# Altium schematic sheet 04_7SEG.SchDoc
size A4
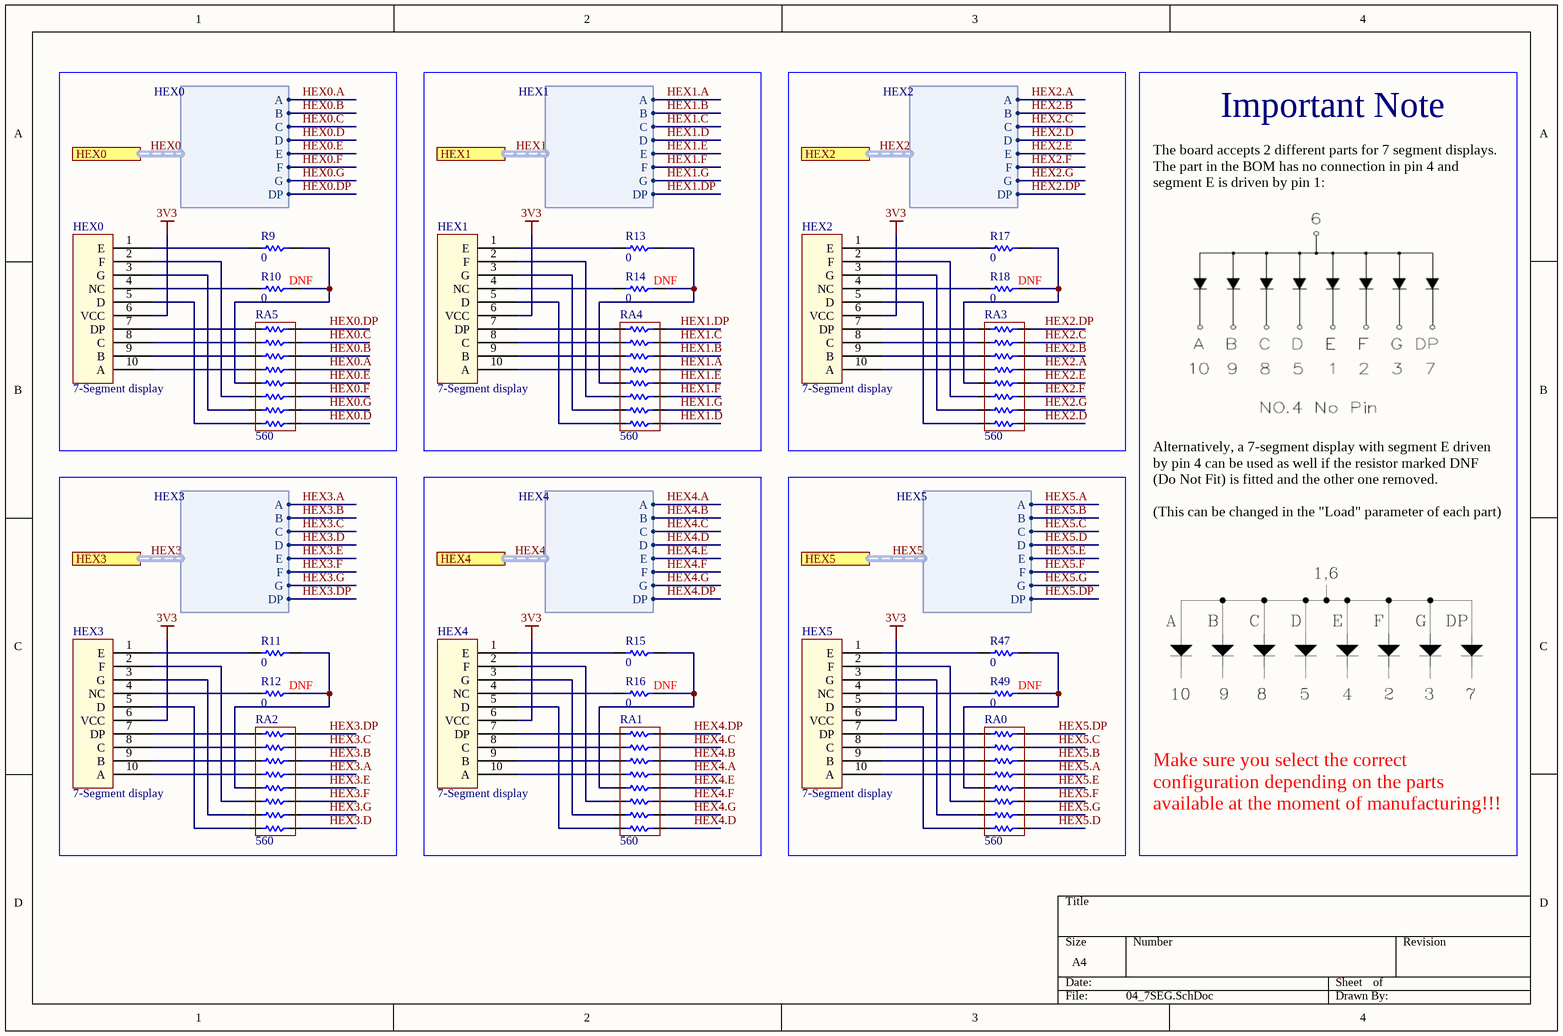
[diagram p0: 04_7SEG.SchDoc]

## Parts
HEX0  7-Segment display  [Seven_Seg_INND-TS40]
HEX1  7-Segment display  [Seven_Seg_INND-TS40]
HEX2  7-Segment display  [Seven_Seg_INND-TS40]
HEX3  7-Segment display  [Seven_Seg_INND-TS40]
HEX4  7-Segment display  [Seven_Seg_INND-TS40]
HEX5  7-Segment display  [Seven_Seg_INND-TS40]
R9  0  [RES0402R]
R10  Load: DNF  [RES0402R]  (hidden comment: 0)
R11  0  [RES0402R]
R12  Load: DNF  [RES0402R]  (hidden comment: 0)
R13  0  [RES0402R]
R14  Load: DNF  [RES0402R]  (hidden comment: 0)
R15  0  [RES0402R]
R16  Load: DNF  [RES0402R]  (hidden comment: 0)
R17  0  [RES0402R]
R18  Load: DNF  [RES0402R]  (hidden comment: 0)
R47  0  [RES0402R]
R49  Load: DNF  [RES0402R]  (hidden comment: 0)
RA0  value 560  [EXB-2HV]  (hidden comment: Resistor Array)
RA1  value 560  [EXB-2HV]  (hidden comment: Resistor Array)
RA2  value 560  [EXB-2HV]  (hidden comment: Resistor Array)
RA3  value 560  [EXB-2HV]  (hidden comment: Resistor Array)
RA4  value 560  [EXB-2HV]  (hidden comment: Resistor Array)
RA5  value 560  [EXB-2HV]  (hidden comment: Resistor Array)

## Ports
HEX0 (harness HEX0), HEX1 (harness HEX1), HEX2 (harness HEX2), HEX3 (harness HEX3), HEX4 (harness HEX4), HEX5 (harness HEX5)

## Harnesses
HEX0: A, B, C, D, E, F, G, DP
HEX1: A, B, C, D, E, F, G, DP
HEX2: A, B, C, D, E, F, G, DP
HEX3: A, B, C, D, E, F, G, DP
HEX4: A, B, C, D, E, F, G, DP
HEX5: A, B, C, D, E, F, G, DP

## Nets
3V3: HEX0.6(VCC) HEX1.6(VCC) HEX2.6(VCC) HEX3.6(VCC) HEX4.6(VCC) HEX5.6(VCC)
HEX0.A: RA5.13 ; port HEX0.A
HEX0.B: RA5.14 ; port HEX0.B
HEX0.C: RA5.15 ; port HEX0.C
HEX0.D: RA5.9 ; port HEX0.D
HEX0.DP: RA5.16 ; port HEX0.DP
HEX0.E: RA5.12 ; port HEX0.E
HEX0.F: RA5.11 ; port HEX0.F
HEX0.G: RA5.10 ; port HEX0.G
HEX1.A: RA4.13 ; port HEX1.A
HEX1.B: RA4.14 ; port HEX1.B
HEX1.C: RA4.15 ; port HEX1.C
HEX1.D: RA4.9 ; port HEX1.D
HEX1.DP: RA4.16 ; port HEX1.DP
HEX1.E: RA4.12 ; port HEX1.E
HEX1.F: RA4.11 ; port HEX1.F
HEX1.G: RA4.10 ; port HEX1.G
HEX2.A: RA3.13 ; port HEX2.A
HEX2.B: RA3.14 ; port HEX2.B
HEX2.C: RA3.15 ; port HEX2.C
HEX2.D: RA3.9 ; port HEX2.D
HEX2.DP: RA3.16 ; port HEX2.DP
HEX2.E: RA3.12 ; port HEX2.E
HEX2.F: RA3.11 ; port HEX2.F
HEX2.G: RA3.10 ; port HEX2.G
HEX3.A: RA2.13 ; port HEX3.A
HEX3.B: RA2.14 ; port HEX3.B
HEX3.C: RA2.15 ; port HEX3.C
HEX3.D: RA2.9 ; port HEX3.D
HEX3.DP: RA2.16 ; port HEX3.DP
HEX3.E: RA2.12 ; port HEX3.E
HEX3.F: RA2.11 ; port HEX3.F
HEX3.G: RA2.10 ; port HEX3.G
HEX4.A: RA1.13 ; port HEX4.A
HEX4.B: RA1.14 ; port HEX4.B
HEX4.C: RA1.15 ; port HEX4.C
HEX4.D: RA1.9 ; port HEX4.D
HEX4.DP: RA1.16 ; port HEX4.DP
HEX4.E: RA1.12 ; port HEX4.E
HEX4.F: RA1.11 ; port HEX4.F
HEX4.G: RA1.10 ; port HEX4.G
HEX5.A: RA0.13 ; port HEX5.A
HEX5.B: RA0.14 ; port HEX5.B
HEX5.C: RA0.15 ; port HEX5.C
HEX5.D: RA0.9 ; port HEX5.D
HEX5.DP: RA0.16 ; port HEX5.DP
HEX5.E: RA0.12 ; port HEX5.E
HEX5.F: RA0.11 ; port HEX5.F
HEX5.G: RA0.10 ; port HEX5.G
NetHEX0_1: HEX0.1(E) R9.2
NetHEX0_2: HEX0.2(F) RA5.6
NetHEX0_3: HEX0.3(G) RA5.7
NetHEX0_4: HEX0.4(NC) R10.2
NetHEX0_5: HEX0.5(D) RA5.8
NetHEX0_7: HEX0.7(DP) RA5.1
NetHEX0_8: HEX0.8(C) RA5.2
NetHEX0_9: HEX0.9(B) RA5.3
NetHEX0_10: HEX0.10(A) RA5.4
NetHEX1_1: HEX1.1(E) R13.2
NetHEX1_2: HEX1.2(F) RA4.6
NetHEX1_3: HEX1.3(G) RA4.7
NetHEX1_4: HEX1.4(NC) R14.2
NetHEX1_5: HEX1.5(D) RA4.8
NetHEX1_7: HEX1.7(DP) RA4.1
NetHEX1_8: HEX1.8(C) RA4.2
NetHEX1_9: HEX1.9(B) RA4.3
NetHEX1_10: HEX1.10(A) RA4.4
NetHEX2_1: HEX2.1(E) R17.2
NetHEX2_2: HEX2.2(F) RA3.6
NetHEX2_3: HEX2.3(G) RA3.7
NetHEX2_4: HEX2.4(NC) R18.2
NetHEX2_5: HEX2.5(D) RA3.8
NetHEX2_7: HEX2.7(DP) RA3.1
NetHEX2_8: HEX2.8(C) RA3.2
NetHEX2_9: HEX2.9(B) RA3.3
NetHEX2_10: HEX2.10(A) RA3.4
NetHEX3_1: HEX3.1(E) R11.2
NetHEX3_2: HEX3.2(F) RA2.6
NetHEX3_3: HEX3.3(G) RA2.7
NetHEX3_4: HEX3.4(NC) R12.2
NetHEX3_5: HEX3.5(D) RA2.8
NetHEX3_7: HEX3.7(DP) RA2.1
NetHEX3_8: HEX3.8(C) RA2.2
NetHEX3_9: HEX3.9(B) RA2.3
NetHEX3_10: HEX3.10(A) RA2.4
NetHEX4_1: HEX4.1(E) R15.2
NetHEX4_2: HEX4.2(F) RA1.6
NetHEX4_3: HEX4.3(G) RA1.7
NetHEX4_4: HEX4.4(NC) R16.2
NetHEX4_5: HEX4.5(D) RA1.8
NetHEX4_7: HEX4.7(DP) RA1.1
NetHEX4_8: HEX4.8(C) RA1.2
NetHEX4_9: HEX4.9(B) RA1.3
NetHEX4_10: HEX4.10(A) RA1.4
NetHEX5_1: HEX5.1(E) R47.2
NetHEX5_2: HEX5.2(F) RA0.6
NetHEX5_3: HEX5.3(G) RA0.7
NetHEX5_4: HEX5.4(NC) R49.2
NetHEX5_5: HEX5.5(D) RA0.8
NetHEX5_7: HEX5.7(DP) RA0.1
NetHEX5_8: HEX5.8(C) RA0.2
NetHEX5_9: HEX5.9(B) RA0.3
NetHEX5_10: HEX5.10(A) RA0.4
NetR9_1: R9.1 R10.1 RA5.5
NetR11_1: R11.1 R12.1 RA2.5
NetR13_1: R13.1 R14.1 RA4.5
NetR15_1: R15.1 R16.1 RA1.5
NetR17_1: R17.1 R18.1 RA3.5
NetR47_1: R47.1 R49.1 RA0.5

## Buses and harness runs
harness HEX0 = port HEX0
harness HEX1 = port HEX1
harness HEX2 = port HEX2
harness HEX3 = port HEX3
harness HEX4 = port HEX4
harness HEX5 = port HEX5

## Notes on the sheet
- Important Note
- The board accepts 2 different parts for 7 segment displays. The part in the BOM has no connection in pin 4 and segment E is driven by pin 1:
- Alternatively, a 7-segment display with segment E driven by pin 4 can be used as well if the resistor marked DNF (Do Not Fit) is fitted and the other one removed.
  (This can be changed in the "Load" parameter of each part)
- Make sure you select the correct configuration depending on the parts available at the moment of manufacturing!!!

## Library data of the parts
HEX0-HEX5 = SevenSeg: 01 Created By: Thomas Harper (12/03/2017); 02 Reviewed By: Rodrigo Maureira (27/03/2018); Load: YES; Color: Red; Published: 12-Mar-2018; Publisher: MUEEC; Supplier 1: Digi-Key; Supplier Part Number 1: 1830-1152-ND; Type: Common Anode; Mount: T/H
R9 R11 R13 R15 R17 R47 = R: Resistor; Load: YES; Mount: SMD; Supplier 1: Digi-Key; Supplier Part Number 1: 311-0.0LRCT-ND; Value: 0
R10 R12 R14 R16 R18 R49 = R: Resistor; Mount: SMD; Supplier 1: Digi-Key; Supplier Part Number 1: 311-0.0LRCT-ND; Value: 0
RA0-RA4 = Res Array: Resistor Array with 8 Isolated Resistors; Num of Resistors: 8; Load: YES; Type: Isolated; Supplier 1: Digi-Key; Supplier Part Number 1: Y1561CT-ND; Mount: SMD
RA5 = Res Array: Resistor Array with 8 Isolated Resistors; Num of Resistors: 8; 01 Created By: Thomas Harper (12/03/2017); 02 Reviewed By: Rodrigo Maureira (27/03/2018); Load: YES; Type: Isolated; Published: 12-Mar-2018; Publisher: MUEEC; Supplier 1: Digi-Key; Supplier Part Number 1: Y1561CT-ND